# Altium schematic sheet GS_01_Core.SchDoc: Title
size A2; Date: Date; CompanyName: Integrated Micro-Electronics Bulgaria; Organization: Design & Development Department; Address1: Drawing Type; Address2: Address 1; Address3: Address 2; Address4: Address 3; DocumentNumber: 730xxx; Revision: 01; SheetNumber: 1; SheetTotal: 1; PageSetup: Record=PageOptions|CenterHorizontal=True|CenterVertical=True|PrintScale=0.70|XCorrection=1.00|YCorrection=1.00|PrintKind=2|BorderSize=5000000|LeftOffset=0|BottomOffset=0|Orientation=2|PaperLength=1000|PaperWidth=1000|Scale=100|PaperSource=7|PrintQuality=-4|MediaType=1|DitherType=10|PaperKind=A4|PrintScaleMode=1; SheetSize: A3; Time: Time; ModifiedDate: Mod. Date
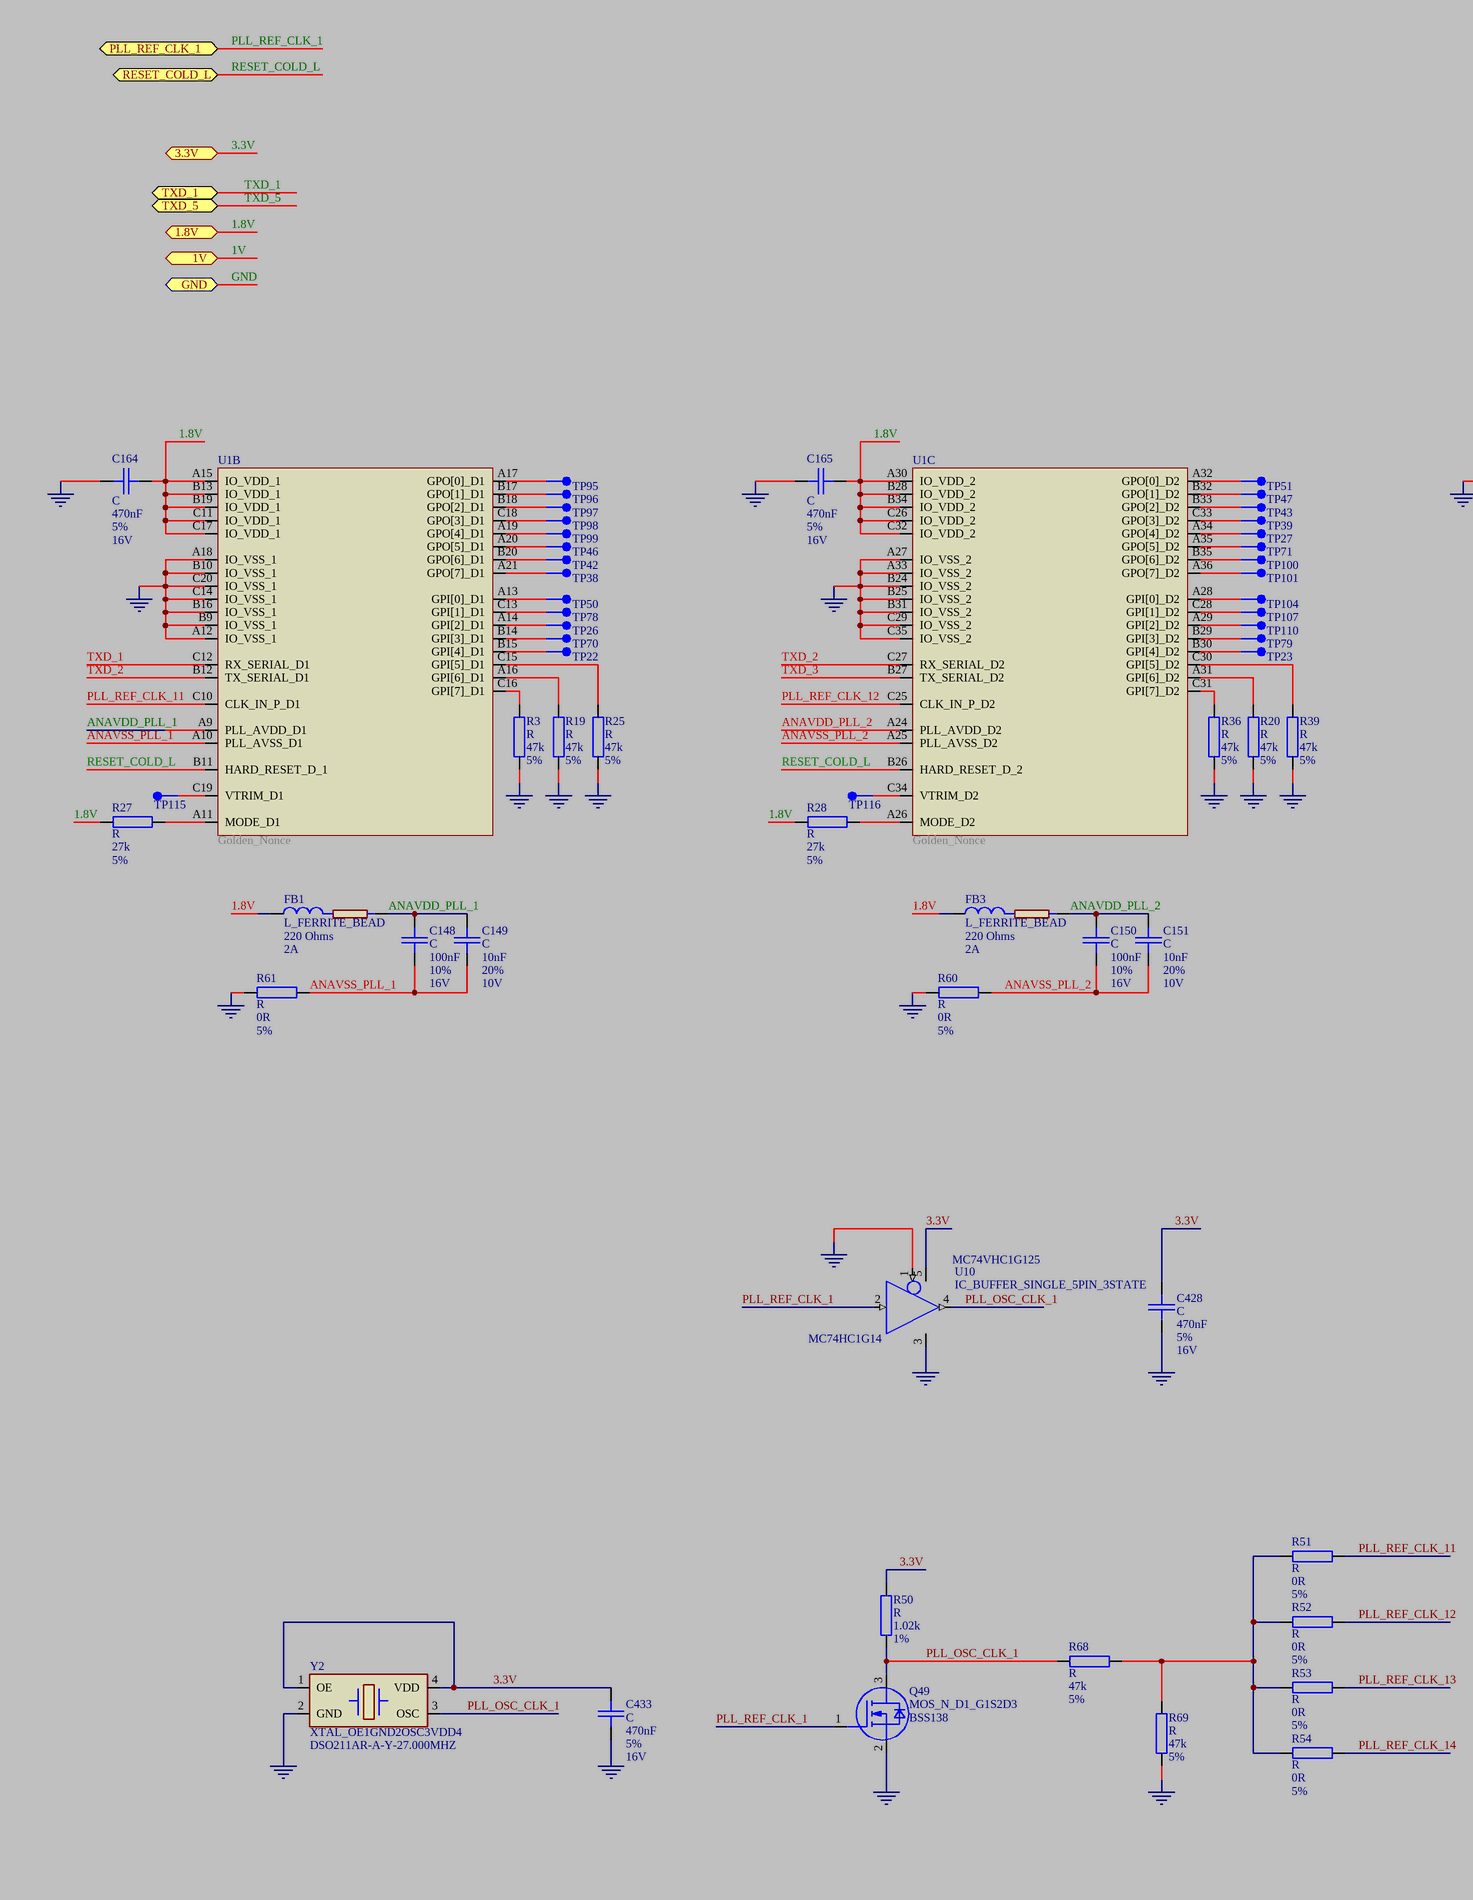
[diagram p0: GS_01_Core.SchDoc, left]
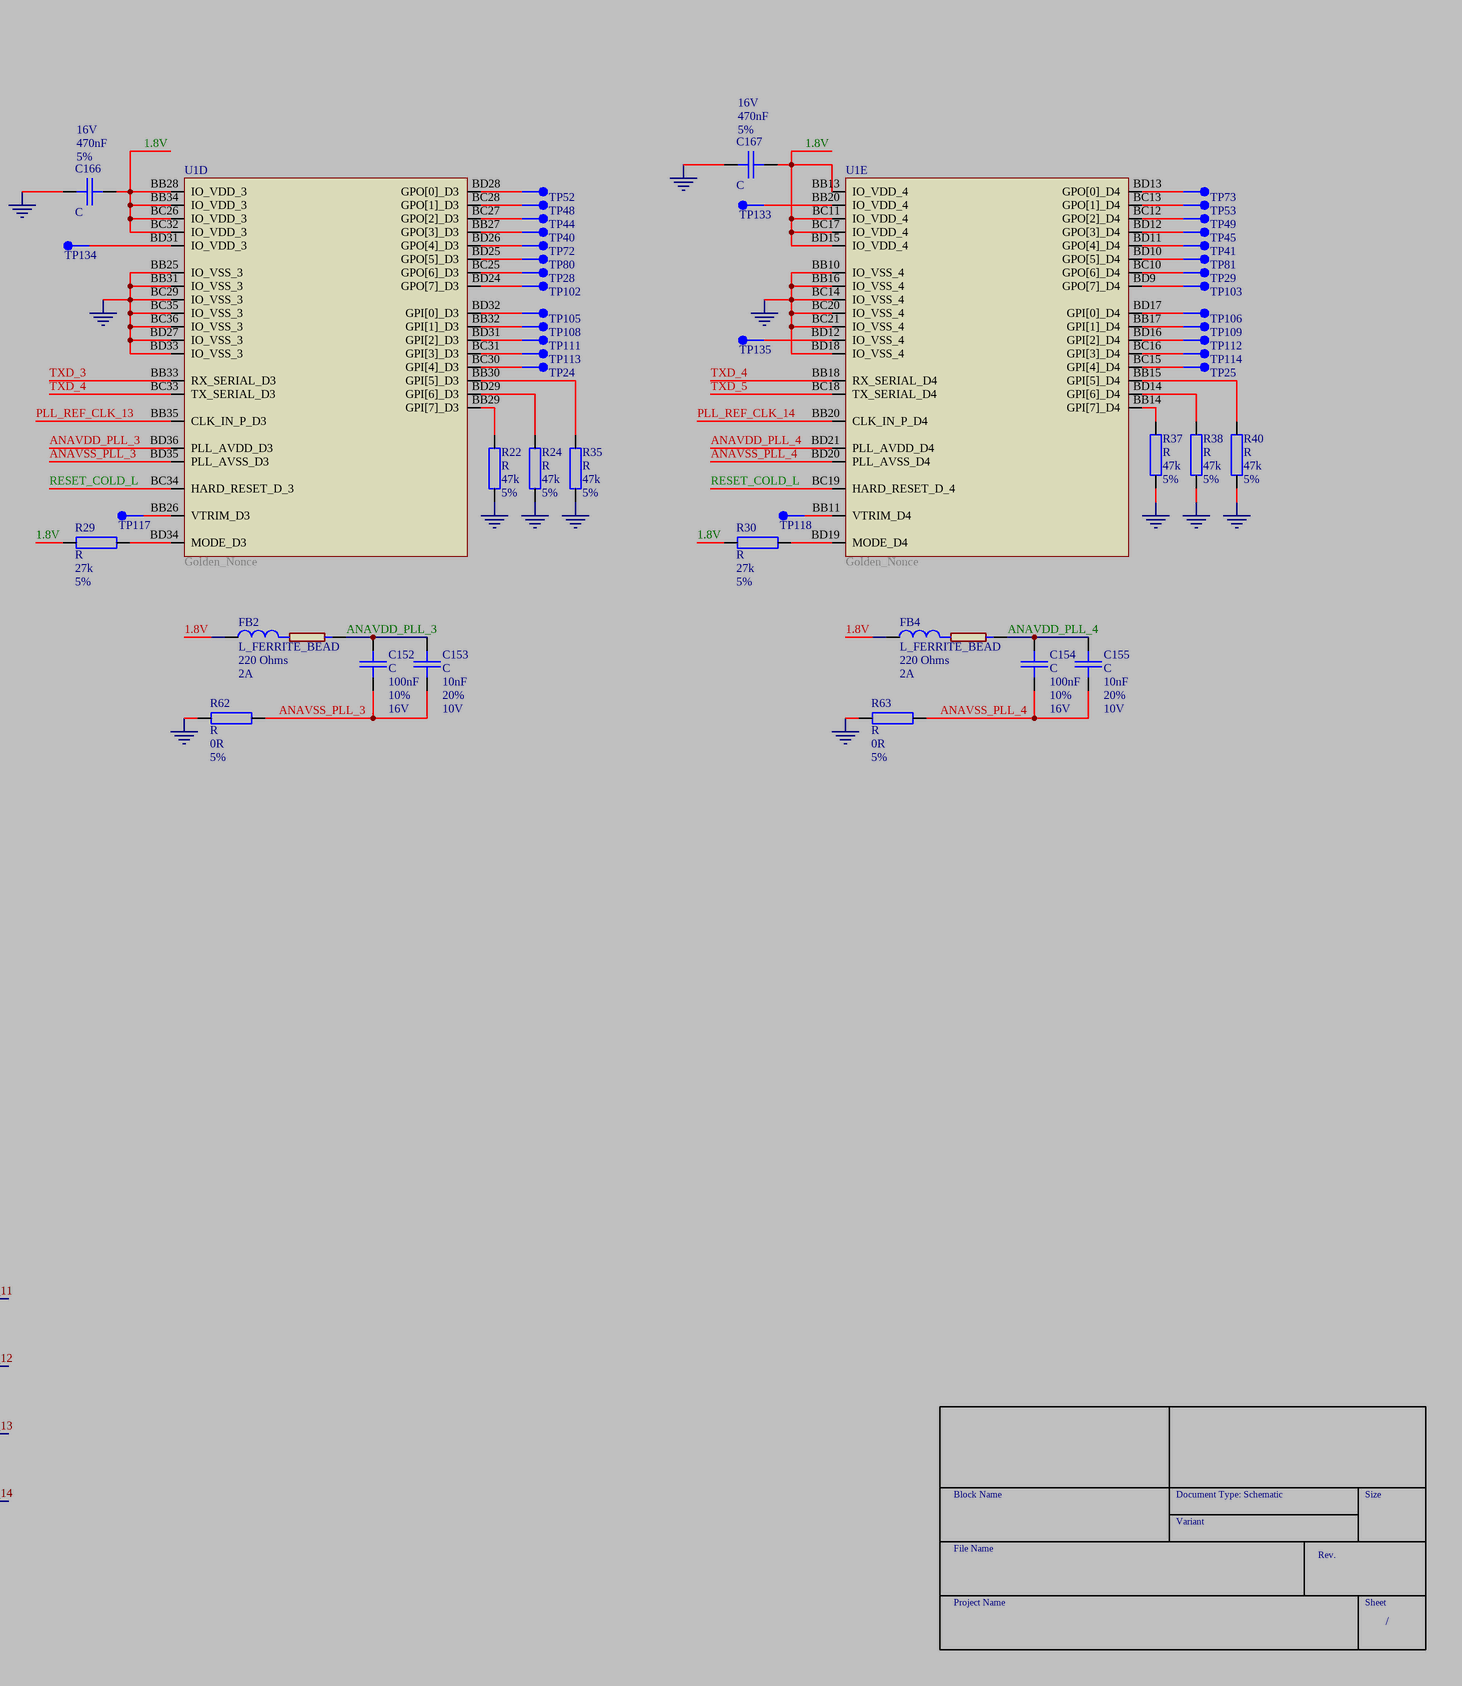
[diagram p1: GS_01_Core.SchDoc, right]

## Parts
C148  C  DB_VALUE: 100nF  DB_TOLERANCE: 10%  DB_VOLTAGE: 16V  [SMD_0603_CAPC1608X95N]
C149  C  DB_VALUE: 10nF  DB_TOLERANCE: 20%  DB_VOLTAGE: 10V  [SMD_0603_CAPC1608X95N]
C150  C  DB_VALUE: 100nF  DB_TOLERANCE: 10%  DB_VOLTAGE: 16V  [SMD_0603_CAPC1608X95N]
C151  C  DB_VALUE: 10nF  DB_TOLERANCE: 20%  DB_VOLTAGE: 10V  [SMD_0603_CAPC1608X95N]
C152  C  DB_VALUE: 100nF  DB_TOLERANCE: 10%  DB_VOLTAGE: 16V  [SMD_0603_CAPC1608X95N]
C153  C  DB_VALUE: 10nF  DB_TOLERANCE: 20%  DB_VOLTAGE: 10V  [SMD_0603_CAPC1608X95N]
C154  C  DB_VALUE: 100nF  DB_TOLERANCE: 10%  DB_VOLTAGE: 16V  [SMD_0603_CAPC1608X95N]
C155  C  DB_VALUE: 10nF  DB_TOLERANCE: 20%  DB_VOLTAGE: 10V  [SMD_0603_CAPC1608X95N]
C164  C  DB_VALUE: 470nF  DB_TOLERANCE: 5%  DB_VOLTAGE: 16V  [SMD_0603_CAPC1608X95N]
C165  C  DB_VALUE: 470nF  DB_TOLERANCE: 5%  DB_VOLTAGE: 16V  [SMD_0603_CAPC1608X95N]
C166  C  DB_VALUE: 470nF  DB_TOLERANCE: 5%  DB_VOLTAGE: 16V  [SMD_0603_CAPC1608X95N]
C167  C  DB_VALUE: 470nF  DB_TOLERANCE: 5%  DB_VOLTAGE: 16V  [SMD_0603_CAPC1608X95N]
C428  C  DB_VALUE: 470nF  DB_TOLERANCE: 5%  DB_VOLTAGE: 16V  [SMD_0603_CAPC1608X95N]
C433  C  DB_VALUE: 470nF  DB_TOLERANCE: 5%  DB_VOLTAGE: 16V  [SMD_0603_CAPC1608X95N]
FB1  L_FERRITE_BEAD  DB_VALUE: 220 Ohms  DB_CURRENT: 2A  [SMD_0805_INDC2012X105N]
FB2  L_FERRITE_BEAD  DB_VALUE: 220 Ohms  DB_CURRENT: 2A  [SMD_0805_INDC2012X105N]
FB3  L_FERRITE_BEAD  DB_VALUE: 220 Ohms  DB_CURRENT: 2A  [SMD_0805_INDC2012X105N]
FB4  L_FERRITE_BEAD  DB_VALUE: 220 Ohms  DB_CURRENT: 2A  [SMD_0805_INDC2012X105N]
Q49  MOS_N_D1_G1S2D3  DB_VALUE: BSS138  [SMD_SOT23_SOT95P240X112-3N]
R3  R  DB_VALUE: 47k  DB_TOLERANCE: 5%  [SMD_0603_RESC1608X55N]
R19  R  DB_VALUE: 47k  DB_TOLERANCE: 5%  [SMD_0603_RESC1608X55N]
R20  R  DB_VALUE: 47k  DB_TOLERANCE: 5%  [SMD_0603_RESC1608X55N]
R22  R  DB_VALUE: 47k  DB_TOLERANCE: 5%  [SMD_0603_RESC1608X55N]
R24  R  DB_VALUE: 47k  DB_TOLERANCE: 5%  [SMD_0603_RESC1608X55N]
R25  R  DB_VALUE: 47k  DB_TOLERANCE: 5%  [SMD_0603_RESC1608X55N]
R27  R  DB_VALUE: 27k  DB_TOLERANCE: 5%  [SMD_0603_RESC1608X55N]
R28  R  DB_VALUE: 27k  DB_TOLERANCE: 5%  [SMD_0603_RESC1608X55N]
R29  R  DB_VALUE: 27k  DB_TOLERANCE: 5%  [SMD_0603_RESC1608X55N]
R30  R  DB_VALUE: 27k  DB_TOLERANCE: 5%  [SMD_0603_RESC1608X55N]
R35  R  DB_VALUE: 47k  DB_TOLERANCE: 5%  [SMD_0603_RESC1608X55N]
R36  R  DB_VALUE: 47k  DB_TOLERANCE: 5%  [SMD_0603_RESC1608X55N]
R37  R  DB_VALUE: 47k  DB_TOLERANCE: 5%  [SMD_0603_RESC1608X55N]
R38  R  DB_VALUE: 47k  DB_TOLERANCE: 5%  [SMD_0603_RESC1608X55N]
R39  R  DB_VALUE: 47k  DB_TOLERANCE: 5%  [SMD_0603_RESC1608X55N]
R40  R  DB_VALUE: 47k  DB_TOLERANCE: 5%  [SMD_0603_RESC1608X55N]
R50  R  DB_VALUE: 1.02k  DB_TOLERANCE: 1%  [SMD_0603_RESC1608X55N]
R51  R  DB_VALUE: 0R  DB_TOLERANCE: 5%  [SMD_0603_RESC1608X55N]
R52  R  DB_VALUE: 0R  DB_TOLERANCE: 5%  [SMD_0603_RESC1608X55N]
R53  R  DB_VALUE: 0R  DB_TOLERANCE: 5%  [SMD_0603_RESC1608X55N]
R54  R  DB_VALUE: 0R  DB_TOLERANCE: 5%  [SMD_0603_RESC1608X55N]
R60  R  DB_VALUE: 0R  DB_TOLERANCE: 5%  [SMD_0402_RESC1005X37N]
R61  R  DB_VALUE: 0R  DB_TOLERANCE: 5%  [SMD_0402_RESC1005X37N]
R62  R  DB_VALUE: 0R  DB_TOLERANCE: 5%  [SMD_0402_RESC1005X37N]
R63  R  DB_VALUE: 0R  DB_TOLERANCE: 5%  [SMD_0402_RESC1005X37N]
R68  R  DB_VALUE: 47k  DB_TOLERANCE: 5%  [SMD_0603_RESC1608X55N]
R69  R  DB_VALUE: 47k  DB_TOLERANCE: 5%  [SMD_0603_RESC1608X55N]
TP22  TEST_POINT_1  [SMD_TP_100-254]  (value not drawn)
TP23  TEST_POINT_1  [SMD_TP_100-254]  (value not drawn)
TP24  TEST_POINT_1  [SMD_TP_100-254]  (value not drawn)
TP25  TEST_POINT_1  [SMD_TP_100-254]  (value not drawn)
TP26  TEST_POINT_1  [SMD_TP_100-254]  (value not drawn)
TP27  TEST_POINT_1  [SMD_TP_100-254]  (value not drawn)
TP28  TEST_POINT_1  [SMD_TP_100-254]  (value not drawn)
TP29  TEST_POINT_1  [SMD_TP_100-254]  (value not drawn)
TP38  TEST_POINT_1  [SMD_TP_100-254]  (value not drawn)
TP39  TEST_POINT_1  [SMD_TP_100-254]  (value not drawn)
TP40  TEST_POINT_1  [SMD_TP_100-254]  (value not drawn)
TP41  TEST_POINT_1  [SMD_TP_100-254]  (value not drawn)
TP42  TEST_POINT_1  [SMD_TP_100-254]  (value not drawn)
TP43  TEST_POINT_1  [SMD_TP_100-254]  (value not drawn)
TP44  TEST_POINT_1  [SMD_TP_100-254]  (value not drawn)
TP45  TEST_POINT_1  [SMD_TP_100-254]  (value not drawn)
TP46  TEST_POINT_1  [SMD_TP_100-254]  (value not drawn)
TP47  TEST_POINT_1  [SMD_TP_100-254]  (value not drawn)
TP48  TEST_POINT_1  [SMD_TP_100-254]  (value not drawn)
TP49  TEST_POINT_1  [SMD_TP_100-254]  (value not drawn)
TP50  TEST_POINT_1  [SMD_TP_100-254]  (value not drawn)
TP51  TEST_POINT_1  [SMD_TP_100-254]  (value not drawn)
TP52  TEST_POINT_1  [SMD_TP_100-254]  (value not drawn)
TP53  TEST_POINT_1  [SMD_TP_100-254]  (value not drawn)
TP70  TEST_POINT_1  [SMD_TP_100-254]  (value not drawn)
TP71  TEST_POINT_1  [SMD_TP_100-254]  (value not drawn)
TP72  TEST_POINT_1  [SMD_TP_100-254]  (value not drawn)
TP73  TEST_POINT_1  [SMD_TP_100-254]  (value not drawn)
TP78  TEST_POINT_1  [SMD_TP_100-254]  (value not drawn)
TP79  TEST_POINT_1  [SMD_TP_100-254]  (value not drawn)
TP80  TEST_POINT_1  [SMD_TP_100-254]  (value not drawn)
TP81  TEST_POINT_1  [SMD_TP_100-254]  (value not drawn)
TP95  TEST_POINT_1  [SMD_TP_100-254]  (value not drawn)
TP96  TEST_POINT_1  [SMD_TP_100-254]  (value not drawn)
TP97  TEST_POINT_1  [SMD_TP_100-254]  (value not drawn)
TP98  TEST_POINT_1  [SMD_TP_100-254]  (value not drawn)
TP99  TEST_POINT_1  [SMD_TP_100-254]  (value not drawn)
TP100  TEST_POINT_1  [SMD_TP_100-254]  (value not drawn)
TP101  TEST_POINT_1  [SMD_TP_100-254]  (value not drawn)
TP102  TEST_POINT_1  [SMD_TP_100-254]  (value not drawn)
TP103  TEST_POINT_1  [SMD_TP_100-254]  (value not drawn)
TP104  TEST_POINT_1  [SMD_TP_100-254]  (value not drawn)
TP105  TEST_POINT_1  [SMD_TP_100-254]  (value not drawn)
TP106  TEST_POINT_1  [SMD_TP_100-254]  (value not drawn)
TP107  TEST_POINT_1  [SMD_TP_100-254]  (value not drawn)
TP108  TEST_POINT_1  [SMD_TP_100-254]  (value not drawn)
TP109  TEST_POINT_1  [SMD_TP_100-254]  (value not drawn)
TP110  TEST_POINT_1  [SMD_TP_100-254]  (value not drawn)
TP111  TEST_POINT_1  [SMD_TP_100-254]  (value not drawn)
TP112  TEST_POINT_1  [SMD_TP_100-254]  (value not drawn)
TP113  TEST_POINT_1  [SMD_TP_100-254]  (value not drawn)
TP114  TEST_POINT_1  [SMD_TP_100-254]  (value not drawn)
TP115  TEST_POINT_1  [SMD_TP_100-254]  (value not drawn)
TP116  TEST_POINT_1  [SMD_TP_100-254]  (value not drawn)
TP117  TEST_POINT_1  [SMD_TP_100-254]  (value not drawn)
TP118  TEST_POINT_1  [SMD_TP_100-254]  (value not drawn)
TP133  TEST_POINT_1  [SMD_TP_100-254]  (value not drawn)
TP134  TEST_POINT_1  [SMD_TP_100-254]  (value not drawn)
TP135  TEST_POINT_1  [SMD_TP_100-254]  (value not drawn)
U1  Golden_Nonce  (parts B,C,D,E of 5)
U10  IC_BUFFER_SINGLE_5PIN_3STATE  DB_VALUE: MC74VHC1G125  [SMD_SOT95P280X110-5N]
Y2  XTAL_OE1GND2OSC3VDD4  DB_VALUE: DSO211AR-A-Y-27.000MHZ  [SMD_OSCCC500X700X100-4N]

## Ports
1.8V, 1V, 3.3V, GND, PLL_REF_CLK_1, RESET_COLD_L, TXD_1, TXD_5

## Nets
GND: C164.1 C165.1 C166.1 C167.1 C428.1 C433.1 Q49.2(S) R3.2 R19.2 R20.2 R22.2 R24.2 R25.2 R35.2 R36.2 R37.2 R38.2 R39.2 R40.2 R60.1 R61.1 R62.1 R63.1 R69.2 U1.A12(IO_VSS_1) U1.A18(IO_VSS_1) U1.A27(IO_VSS_2) U1.A33(IO_VSS_2) U1.B9(IO_VSS_1) U1.B10(IO_VSS_1) U1.B16(IO_VSS_1) U1.B24(IO_VSS_2) U1.B25(IO_VSS_2) U1.B31(IO_VSS_2) U1.BB10(IO_VSS_4) U1.BB16(IO_VSS_4) U1.BB25(IO_VSS_3) U1.BB31(IO_VSS_3) U1.BC14(IO_VSS_4) U1.BC20(IO_VSS_4) U1.BC21(IO_VSS_4) U1.BC29(IO_VSS_3) U1.BC35(IO_VSS_3) U1.BC36(IO_VSS_3) U1.BD18(IO_VSS_4) U1.BD27(IO_VSS_3) U1.BD33(IO_VSS_3) U1.C14(IO_VSS_1) U1.C20(IO_VSS_1) U1.C29(IO_VSS_2) U1.C35(IO_VSS_2) U10.1(~{OE}) U10.3(GND) Y2.2(GND) ; port GND
1.8V: C164.2 C165.2 C166.2 C167.2 FB1.1 FB2.1 FB3.1 FB4.1 R27.1 R28.1 R29.1 R30.1 U1.A15(IO_VDD_1) U1.A30(IO_VDD_2) U1.B13(IO_VDD_1) U1.B19(IO_VDD_1) U1.B28(IO_VDD_2) U1.B34(IO_VDD_2) U1.BB13(IO_VDD_4) U1.BB28(IO_VDD_3) U1.BB34(IO_VDD_3) U1.BC11(IO_VDD_4) U1.BC17(IO_VDD_4) U1.BC26(IO_VDD_3) U1.BC32(IO_VDD_3) U1.BD15(IO_VDD_4) U1.C11(IO_VDD_1) U1.C17(IO_VDD_1) U1.C26(IO_VDD_2) U1.C32(IO_VDD_2) ; port 1.8V
1V: port 1V
3.3V: C428.2 C433.2 R50.1 U10.5(VCC) Y2.1(OE) Y2.4(VDD) ; port 3.3V
ANAVDD_PLL_1: C148.1 C149.1 FB1.2 U1.A9(PLL_AVDD_D1)
ANAVDD_PLL_2: C150.1 C151.1 FB3.2 U1.A24(PLL_AVDD_D2)
ANAVDD_PLL_3: C152.1 C153.1 FB2.2 U1.BD36(PLL_AVDD_D3)
ANAVDD_PLL_4: C154.1 C155.1 FB4.2 U1.BD21(PLL_AVDD_D4)
ANAVSS_PLL_1: C148.2 C149.2 R61.2 U1.A10(PLL_AVSS_D1)
ANAVSS_PLL_2: C150.2 C151.2 R60.2 U1.A25(PLL_AVSS_D2)
ANAVSS_PLL_3: C152.2 C153.2 R62.2 U1.BD35(PLL_AVSS_D3)
ANAVSS_PLL_4: C154.2 C155.2 R63.2 U1.BD20(PLL_AVSS_D4)
PLL_OSC_CLK_1: Q49.3(D) R50.2 R68.1 U10.4(OUTY) Y2.3(OSC)
PLL_REF_CLK_1: Q49.1(G) U10.2(INA) ; port PLL_REF_CLK_1
PLL_REF_CLK_11: R51.2 U1.C10(CLK_IN_P_D1)
PLL_REF_CLK_12: R52.2 U1.C25(CLK_IN_P_D2)
PLL_REF_CLK_13: R53.2 U1.BB35(CLK_IN_P_D3)
PLL_REF_CLK_14: R54.2 U1.BB20(CLK_IN_P_D4)
RESET_COLD_L: U1.B11(HARD_RESET_D_1) U1.B26(HARD_RESET_D_2) U1.BC19(HARD_RESET_D_4) U1.BC34(HARD_RESET_D_3) ; port RESET_COLD_L
TXD_1: U1.C12(RX_SERIAL_D1) ; port TXD_1
TXD_2: U1.B12(TX_SERIAL_D1) U1.C27(RX_SERIAL_D2)
TXD_3: U1.B27(TX_SERIAL_D2) U1.BB33(RX_SERIAL_D3)
TXD_4: U1.BB18(RX_SERIAL_D4) U1.BC33(TX_SERIAL_D3)
TXD_5: U1.BC18(TX_SERIAL_D4) ; port TXD_5
NetR3_1: R3.1 U1.C16(GPI[7]_D1)
NetR19_1: R19.1 U1.A16(GPI[6]_D1)
NetR20_1: R20.1 U1.A31(GPI[6]_D2)
NetR22_1: R22.1 U1.BB29(GPI[7]_D3)
NetR24_1: R24.1 U1.BD29(GPI[6]_D3)
NetR25_1: R25.1 U1.C15(GPI[5]_D1)
NetR27_2: R27.2 U1.A11(MODE_D1)
NetR28_2: R28.2 U1.A26(MODE_D2)
NetR29_2: R29.2 U1.BD34(MODE_D3)
NetR30_2: R30.2 U1.BD19(MODE_D4)
NetR35_1: R35.1 U1.BB30(GPI[5]_D3)
NetR36_1: R36.1 U1.C31(GPI[7]_D2)
NetR37_1: R37.1 U1.BB14(GPI[7]_D4)
NetR38_1: R38.1 U1.BD14(GPI[6]_D4)
NetR39_1: R39.1 U1.C30(GPI[5]_D2)
NetR40_1: R40.1 U1.BB15(GPI[5]_D4)
NetR51_1: R51.1 R52.1 R53.1 R54.1 R68.2 R69.1
NetTP22_1: TP22.1 U1.B15(GPI[4]_D1)
NetTP23_1: TP23.1 U1.B30(GPI[4]_D2)
NetTP24_1: TP24.1 U1.BC30(GPI[4]_D3)
NetTP25_1: TP25.1 U1.BC15(GPI[4]_D4)
NetTP26_1: TP26.1 U1.A14(GPI[2]_D1)
NetTP27_1: TP27.1 U1.A34(GPO[4]_D2)
NetTP28_1: TP28.1 U1.BC25(GPO[6]_D3)
NetTP29_1: TP29.1 U1.BC10(GPO[6]_D4)
NetTP38_1: TP38.1 U1.A21(GPO[7]_D1)
NetTP39_1: TP39.1 U1.C33(GPO[3]_D2)
NetTP40_1: TP40.1 U1.BB27(GPO[3]_D3)
NetTP41_1: TP41.1 U1.BD11(GPO[4]_D4)
NetTP42_1: TP42.1 U1.B20(GPO[6]_D1)
NetTP43_1: TP43.1 U1.B33(GPO[2]_D2)
NetTP44_1: TP44.1 U1.BC27(GPO[2]_D3)
NetTP45_1: TP45.1 U1.BD12(GPO[3]_D4)
NetTP46_1: TP46.1 U1.A20(GPO[5]_D1)
NetTP47_1: TP47.1 U1.B32(GPO[1]_D2)
NetTP48_1: TP48.1 U1.BC28(GPO[1]_D3)
NetTP49_1: TP49.1 U1.BC12(GPO[2]_D4)
NetTP50_1: TP50.1 U1.A13(GPI[0]_D1)
NetTP51_1: TP51.1 U1.A32(GPO[0]_D2)
NetTP52_1: TP52.1 U1.BD28(GPO[0]_D3)
NetTP53_1: TP53.1 U1.BC13(GPO[1]_D4)
NetTP70_1: TP70.1 U1.B14(GPI[3]_D1)
NetTP71_1: TP71.1 U1.A35(GPO[5]_D2)
NetTP72_1: TP72.1 U1.BD26(GPO[4]_D3)
NetTP73_1: TP73.1 U1.BD13(GPO[0]_D4)
NetTP78_1: TP78.1 U1.C13(GPI[1]_D1)
NetTP79_1: TP79.1 U1.B29(GPI[3]_D2)
NetTP80_1: TP80.1 U1.BD25(GPO[5]_D3)
NetTP81_1: TP81.1 U1.BD10(GPO[5]_D4)
NetTP95_1: TP95.1 U1.A17(GPO[0]_D1)
NetTP96_1: TP96.1 U1.B17(GPO[1]_D1)
NetTP97_1: TP97.1 U1.B18(GPO[2]_D1)
NetTP98_1: TP98.1 U1.C18(GPO[3]_D1)
NetTP99_1: TP99.1 U1.A19(GPO[4]_D1)
NetTP100_1: TP100.1 U1.B35(GPO[6]_D2)
NetTP101_1: TP101.1 U1.A36(GPO[7]_D2)
NetTP102_1: TP102.1 U1.BD24(GPO[7]_D3)
NetTP103_1: TP103.1 U1.BD9(GPO[7]_D4)
NetTP104_1: TP104.1 U1.A28(GPI[0]_D2)
NetTP105_1: TP105.1 U1.BD32(GPI[0]_D3)
NetTP106_1: TP106.1 U1.BD17(GPI[0]_D4)
NetTP107_1: TP107.1 U1.C28(GPI[1]_D2)
NetTP108_1: TP108.1 U1.BB32(GPI[1]_D3)
NetTP109_1: TP109.1 U1.BB17(GPI[1]_D4)
NetTP110_1: TP110.1 U1.A29(GPI[2]_D2)
NetTP111_1: TP111.1 U1.BD31(GPI[2]_D3)
NetTP112_1: TP112.1 U1.BD16(GPI[2]_D4)
NetTP113_1: TP113.1 U1.BC31(GPI[3]_D3)
NetTP114_1: TP114.1 U1.BC16(GPI[3]_D4)
NetTP115_1: TP115.1 U1.C19(VTRIM_D1)
NetTP116_1: TP116.1 U1.C34(VTRIM_D2)
NetTP117_1: TP117.1 U1.BB26(VTRIM_D3)
NetTP118_1: TP118.1 U1.BB11(VTRIM_D4)
NetTP133_1: TP133.1 U1.BB20(IO_VDD_4)
NetTP134_1: TP134.1 U1.BD31(IO_VDD_3)
NetTP135_1: TP135.1 U1.BD12(IO_VSS_4)

## Notes on the sheet
- (near U10) MC74HC1G14
- Block Name
- Document Type: Schematic
- Size
- File Name
- Variant
- Rev.
- Project Name
- Sheet
- /

## Library data of the parts
C148 C150 C152 C154 = CAP000047357: DB_MANUFACTURER_PART: YAGEO      223878615649; DB_PART_TYPE: Ceramic_SMD\Standard_X7R; NOTE: <NOTE>; DB_APPROVED_BY: VSN; DB_DESCRIPTION: C X7R 100nF 10% 16V 0603; DB_PACKAGE: 0603; DB_STATUS: NEW; DB_T_RANGE: -55 to 125; DB_PART_NUMBER: CAP000047357; DB_APPROVED_ON: 16.05.2014 14:44:10; DB_DATASHEET: http://john.epiqdesign.com/projects/CIS_Datasheets/22_X7R_YAGEO_capacitor_series_9.pdf?rev=1422&sc=0; DB_PCB_DEVICE: SMD_0603_CAPC1608X95N
C149 C151 C153 C155 = CAP000038821: DB_MANUFACTURER_PART: KEMET    C0603C103M8GAC; DB_PART_TYPE: Ceramic_SMD\Standard_C0G; NOTE: <NOTE>; DB_DESCRIPTION: C C0G 10nF 20% 10V 0603; DB_PACKAGE: 0603; DB_STATUS: NEW; DB_T_RANGE: -55 to 125; DB_PART_NUMBER: CAP000038821; DB_APPROVED_ON: 09.10.2010; DB_DATASHEET: http://john.epiqdesign.com/projects/CIS_Datasheets/F3102_CE_Kemet.pdf?rev=92&sc=0; DB_PCB_DEVICE: SMD_0603_CAPC1608X95N
C164-C167 C428 C433 = CAP000028169: DB_PART_TYPE: Ceramic_SMD\Standard_X7R; DB_MANUFACTURER_PART: KEMET    C0603C474J4RAC; NOTE: <NOTE>; DB_T_RANGE: -55 to 125; DB_PACKAGE: 0603; DB_DESCRIPTION: C X7R 470nF 5% 16V 0603; DB_STATUS: NEW; DB_PART_NUMBER: CAP000028169; DB_PCB_DEVICE: SMD_0603_CAPC1608X95N; DB_APPROVED_ON: 09.10.2010; DB_DATASHEET: http://john.epiqdesign.com/projects/CIS_Datasheets/F3102_CE_Kemet.pdf?rev=92&sc=0
FB1-FB4 = IND000000029: DB_PART_TYPE: Inductor; DB_MANUFACTURER_PART: MURATA       BLM21PG221SN1D; NOTE: <NOTE>; DB_TOLERANCE: 25%; DB_T_RANGE: -55 to 125; DB_PACKAGE: 0805; DB_DESCRIPTION: INDUC 220 Ohms 25% 0805; DB_APPROVED_BY: VSN; DB_STATUS: NEW; DB_PART_NUMBER: IND000000029; DB_PCB_DEVICE: SMD_0805_INDC2012X105N; DB_APPROVED_ON: 30.06.2011 07:59:29; DB_DATASHEET: http://john.epiqdesign.com/projects/CIS_Datasheets/BLM21P_MURATA.pdf?rev=325&sc=0
Q49 = TRA000001460: DB_PART_TYPE: MOSFET\N_Channel; DB_MANUFACTURER_PART: FAIRCHILD        BSS138LT1G; NOTE: <NOTE>; DB_T_RANGE: -55 to 150; DB_VOLTAGE: 50V; DB_CURRENT: 0.22A; DB_PACKAGE: SOT-23-3; DB_DESCRIPTION: TRANS BSS138 SOT-23-3; DB_APPROVED_BY: VSN; DB_STATUS: NEW; DB_PART_NUMBER: TRA000001460; DB_PCB_DEVICE: SMD_SOT23_SOT95P240X112-3N; DB_APPROVED_ON: 14.01.2011 10:29:14; DB_DATASHEET: http://john.epiqdesign.com/projects/CIS_Datasheets/BSS138LT1-D_Fairchild.pdf?rev=55&sc=0
R3 R19 R20 R22 R24 R25 R35-R40 R68 R69 = RES000006462: DB_PART_TYPE: SMD; DB_MANUFACTURER_PART: YAGEO    RC0603JR-0747K; NOTE: <NOTE>; DB_T_RANGE: -55 to 155; DB_POWER: 1/10W; DB_PACKAGE: 0603; DB_DESCRIPTION: R SMD 47K 5% 1/10W 0603; DB_PRICE: 0.000364; DB_MOQ: 5000; DB_STATUS: NEW; R_BDS: R; DB_PART_NUMBER: RES000006462; DB_PCB_DEVICE: SMD_0603_RESC1608X55N; DB_PRICE_DATE: 2010-12-23; DB_APPROVED_ON: 09.10.2010; DB_DATASHEET: http://john.epiqdesign.com/projects/CIS_Datasheets/PYu-RC0603_51_RoHS_L_4_YAGEO.pdf?rev=138&sc=0
R27-R30 = RES000006456: DB_PART_TYPE: SMD; DB_MANUFACTURER_PART: YAGEO    RC0603JR-0727K; NOTE: <NOTE>; DB_T_RANGE: -55 to 155; DB_POWER: 1/10W; DB_PACKAGE: 0603; DB_DESCRIPTION: R SMD 27K 5% 1/10W 0603; DB_PRICE: 0.000364; DB_MOQ: 5000; DB_STATUS: NEW; R_BDS: R; DB_PART_NUMBER: RES000006456; DB_PCB_DEVICE: SMD_0603_RESC1608X55N; DB_PRICE_DATE: 2010-12-23; DB_APPROVED_ON: 09.10.2010; DB_DATASHEET: http://john.epiqdesign.com/projects/CIS_Datasheets/PYu-RC0603_51_RoHS_L_4_YAGEO.pdf?rev=138&sc=0
R50 = RES000001446: DB_PART_TYPE: SMD; DB_MANUFACTURER_PART: YAGEO    RC0603FR-071K02; NOTE: <NOTE>; DB_T_RANGE: -55 to 155; DB_POWER: 1/10W; DB_PACKAGE: 0603; DB_DESCRIPTION: R SMD 1K02 1% 1/10W 0603; DB_PRICE: 0.00063; DB_MOQ: 5000; DB_STATUS: NEW; R_BDS: R; DB_PART_NUMBER: RES000001446; DB_PCB_DEVICE: SMD_0603_RESC1608X55N; DB_PRICE_DATE: 2010-12-23; DB_APPROVED_ON: 09.10.2010; DB_DATASHEET: http://john.epiqdesign.com/projects/CIS_Datasheets/PYu-RC0603_51_RoHS_L_4_YAGEO.pdf?rev=138&sc=0
R51-R54 = RES000006349: DB_PART_TYPE: SMD; DB_MANUFACTURER_PART: YAGEO    RC0603JR-070R; NOTE: <NOTE>; DB_T_RANGE: -55 to 155; DB_POWER: 1/10W; DB_PACKAGE: 0603; DB_DESCRIPTION: R SMD 0R 5% 1/10W 0603; DB_PRICE: 0.000364; DB_MOQ: 5000; DB_STATUS: NEW; R_BDS: R; DB_PART_NUMBER: RES000006349; DB_PCB_DEVICE: SMD_0603_RESC1608X55N; DB_PRICE_DATE: 2010-12-23; DB_APPROVED_ON: 09.10.2010; DB_DATASHEET: http://john.epiqdesign.com/projects/CIS_Datasheets/PYu-RC0603_51_RoHS_L_4_YAGEO.pdf?rev=138&sc=0
R60-R63 = RES000006002: DB_PART_TYPE: SMD; DB_MANUFACTURER_PART: YAGEO    RC0402JR-070R; NOTE: <NOTE>; DB_T_RANGE: -55 to 155; DB_POWER: 1/16W; DB_PACKAGE: 0402; DB_DESCRIPTION: R SMD 0R 5% 1/16W 0402; DB_PRICE: 0.00066; DB_MOQ: 10000; DB_STATUS: NEW; R_BDS: R; DB_PART_NUMBER: RES000006002; DB_PCB_DEVICE: SMD_0402_RESC1005X37N; DB_PRICE_DATE: 2010-12-23; DB_APPROVED_ON: 09.10.2010; DB_DATASHEET: http://john.epiqdesign.com/projects/CIS_Datasheets/PYu-RC0402_51_RoHS_L_6_YAGEO.pdf?rev=138&sc=0
TP22-TP29 TP38-TP53 TP70-TP73 TP78-TP81 TP95-TP118 TP133-TP135 = TPO000000001: DB_PART_TYPE: Test Point; DB_VALUE: 100_254; DB_DESCRIPTION: Test Point 100_254; DB_STATUS: NEW; DB_PART_NUMBER: TPO000000001; DB_DIAMETER: 100_254; DB_PCB_DEVICE: SMD_TP_100-254; DB_APPROVED_ON: 10.09.2010
U10 = DIG000000005: DB_PART_TYPE: Buffer; DB_MANUFACTURER_PART: ON Semiconductor       M74VHC1G125DTT1G; NOTE: <NOTE>; DB_T_RANGE: -55 to 125; DB_PACKAGE: SOT23-5; DB_DESCRIPTION: IC MC74VHC1G125 SOT23-5; DB_APPROVED_BY: VSN; DB_STATUS: NEW; DB_PART_NUMBER: DIG000000005; DB_PCB_DEVICE: SMD_SOT95P280X110-5N; DB_APPROVED_ON: 13.10.2011 11:24:30; DB_DATASHEET: http://john.epiqdesign.com/projects/CIS_Datasheets/MC74VHC1G125-DNoninverting_3-State_Buffer_ON_Semi.pdf?rev=477&sc=0
Y2 = OSC000000015: DB_PART_TYPE: Oscillator; DB_MANUFACTURER_PART: KDS DAISHINKU      DSO211AR-A-Y-27.000MHZ; NOTE: <NOTE>; DB_ACCURACY: 100ppm; DB_T_RANGE: -40 to 125; DB_VOLTAGE: 3.3V; DB_FREQUENCY: 27MHz; DB_PACKAGE: SMT; DB_DESCRIPTION: IC DSO211AR 27MHZ; DB_PCB_DEVICE: SMD_OSCCC160X200X80-4N; DB_CERTIFIED: AUT; DB_APPROVED_BY: VSN; DB_STATUS: NEW; DB_PART_NUMBER: OSC000000015; DB_APPROVED_ON: 09.01.2013 13:52:02; DB_DATASHEET: http://john.epiqdesign.com/projects/CIS_Datasheets/DSO211AR.pdf?rev=1025&sc=0